# EAGLE design Power_Supply (EAGLE 9.6.1)
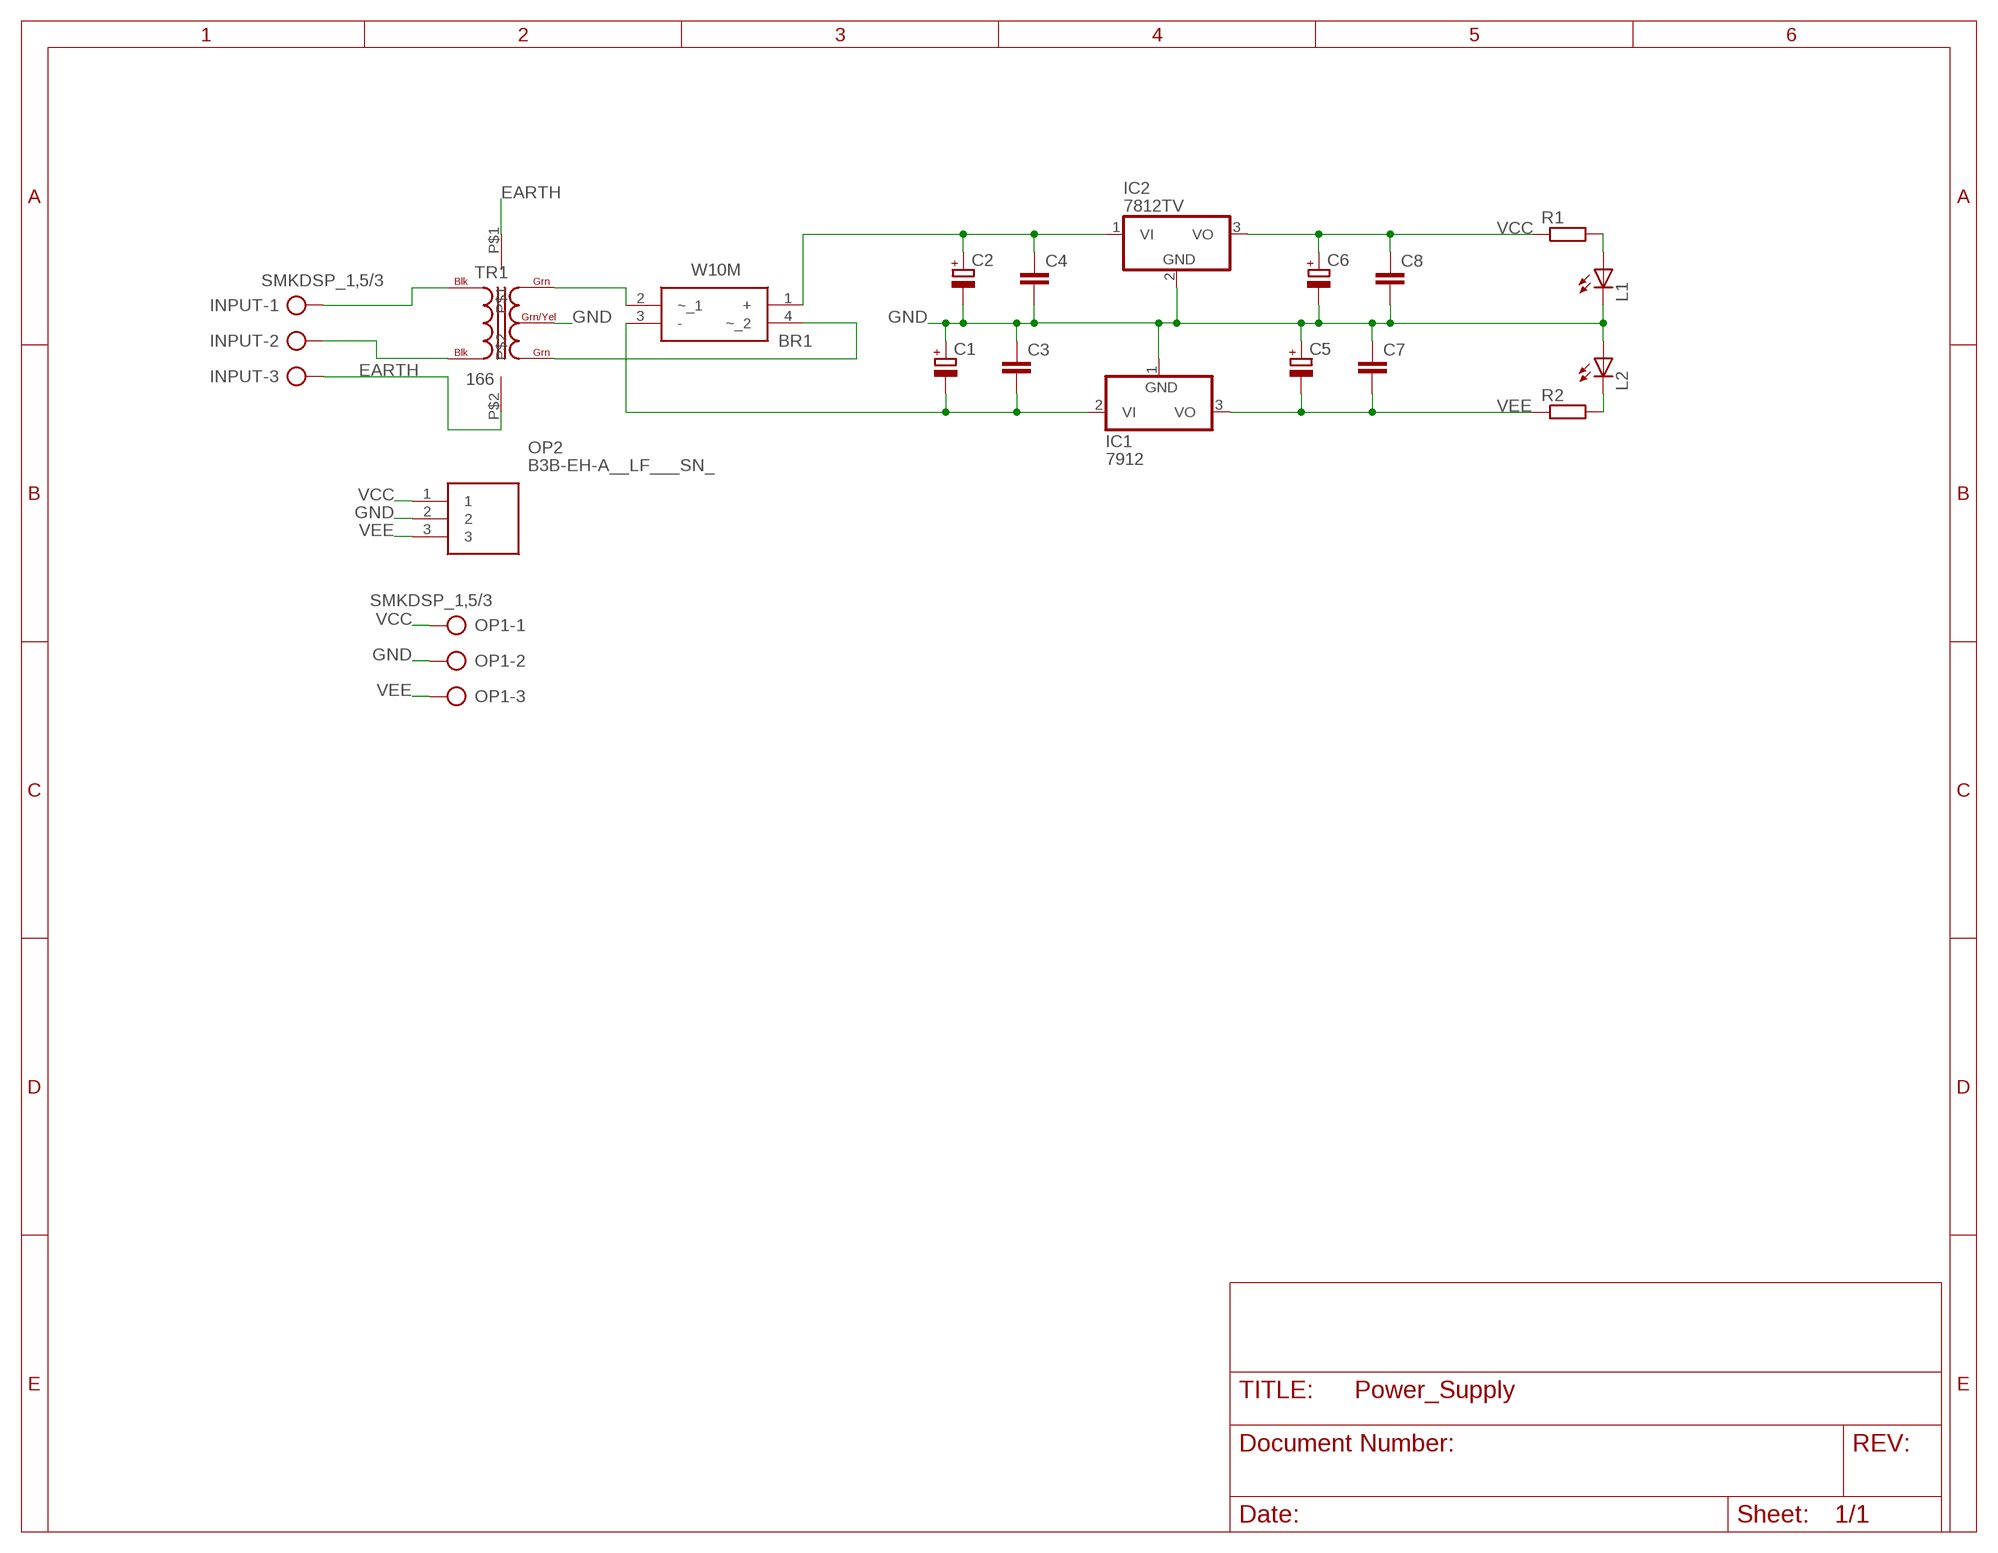
[diagram p0: schematic, sheet 1]

## Parts
BR1  W10M  [WOM]
C1  CPOL-EUE5-10.5  [E5-10,5]
C2  CPOL-EUE5-10.5  [E5-10,5]
C3  C-EU025-025X050  [C025-025X050]
C4  C-EU025-025X050  [C025-025X050]
C5  CPOL-EUE2.5-5  [E2,5-5]
C6  CPOL-EUE2.5-5  [E2,5-5]
C7  C-EU025-025X050  [C025-025X050]
C8  C-EU025-025X050  [C025-025X050]
IC1  7912  79  [TO220V]
IC2  7812TV  [TO220V]
INPUT  SMKDSP_1,5/3  [SMKDSP_1,5/3]
L1  LED3MM  [LED3MM]
L2  LED3MM  [LED3MM]
OP1  SMKDSP_1,5/3  [SMKDSP_1,5/3]
OP2  B3B-EH-A__LF___SN_  [SHDR3W64P0X250_1X3_1000X380X60]
R1  R-EU_0207/10  [0207/10]
R2  R-EU_0207/10  [0207/10]
TR1  166  [C4H]

## Nets
EARTH: INPUT.3 TR1.P$1 TR1.P$2
GND: C1.+ C2.- C3.1 C4.2 C5.+ C6.- C7.1 C8.2 IC1.1(GND) IC2.2(GND) L1.K(C) L2.A OP1.2 OP2.2 TR1.GRN/YEL
N$18: INPUT.1 TR1.BLK@1(BLK)
N$19: INPUT.2 TR1.BLK@2(BLK)
N$23: BR1.2(~_1) TR1.GRN@1(GRN)
N$24: BR1.4(~_2) TR1.GRN@2(GRN)
N$25: BR1.1(+) C2.+ C4.1 IC2.1(VI)
N$27: BR1.3(-) C1.- C3.2 IC1.2(VI)
N$28: L2.K(C) R2.2
N$29: L1.A R1.2
VCC: C6.+ C8.1 IC2.3(VO) OP1.1 OP2.1 R1.1
VEE: C5.- C7.2 IC1.3(VO) OP1.3 OP2.3 R2.1

## Library data of the parts
BR1 = W10M:W10M: Bridge Rectifiers 1.5A 1000V Source: Datasheet <https://www.arrow.com/en/products/w10m/rectron>; ARROW_PART_NUMBER: W10M; ARROW_PRICE-STOCK: https://www.arrow.com/en/products/w10m/rectron; DESCRIPTION: Bridge Rectifiers 1.5A 1000V; HEIGHT: mm; MANUFACTURER_NAME: Rectron; MANUFACTURER_PART_NUMBER: W10M; MOUSER_PART_NUMBER: 583-W10M; MOUSER_PRICE-STOCK: https://www.mouser.co.uk/ProductDetail/Rectron/W10M?qs=eFbYF5x2uRcD6P7vvkVvAQ%3D%3D
C1 C2 C5 C6 = resistor:CPOL-EU: POLARIZED CAPACITOR, European symbol
C3 C4 C7 C8 = resistor:C-EU: CAPACITOR, European symbol
IC1 = linear-Custom:79*: Negative VOLTAGE REGULATOR
IC2 = linear:78*: Positive VOLTAGE REGULATOR Source: http://cache.national.com/ds/LM/LM78L05.pdf http://www.fairchildsemi.com/ds/LM/LM7805.pdf
INPUT OP1 = con-phoenix-smkdsp:SMKDSP_1,5/3: Printklemme, Nennstrom: 17,5 A, Bemessungsspannung: 250 V, Raster: 5,0 mm Source: http://eshop.phoenixcontact.de .. 1733415.pdf; MF: FARNELL; MPN: 1733583; OC_FARNELL: 3041256; OC_NEWARK: 71C4130
L1 L2 = led:LED: LED OSRAM: - CHIPLED LG R971, LG N971, LY N971, LG Q971, LY Q971, LO R971, LY R971 LH N974, LH R974 LS Q976, LO Q976, LY Q976 LO Q996 - Hyper CHIPLED LW Q18S LB Q993, LB Q99A, LB R99A - SideLED LS A670, LO A670, LY A670, LG A670, LP A670 LB A673, LV A673, LT A673, LW A673 LH A674 LY A675 LS A676, LA A676, LO A676, LY A676, LW A676 LS A679, LY A679, LG A679 - Hyper Micro SIDELED® LS Y876, LA Y876, LO Y876, LY Y876 LT Y87S - SmartLED LW L88C, LW L88S LB L89C, LB L89S, LG L890 LS L89K, LO L89K, LY L89K LS L896, LA L896, LO L896, LY L896 - TOPLED LS T670, LO T670, LY T670, LG T670, LP T670 LSG T670, LSP T670, LSY T670, LOP T670, LYG T670 LG T671, LOG T671, LSG T671 LB T673, LV T673, LT T673, LW T673 LH T674 LS T676, LA T676, LO T676, LY T676, LB T676, LH T676, LSB T676, LW T676 LB T67C, LV T67C, LT T67C, LS T67K, LO T67K, LY T67K, LW E67C LS E67B, LA E67B, LO E67B, LY E67B, LB E67C, LV E67C, LT E67C LW T67C LS T679, LY T679, LG T679 LS T770, LO T770, LY T770, LG T770, LP T770 LB T773, LV T773, LT T773, LW T773 LH T774 LS E675, LA E675, LY E675, LS T675 LS T776, LA T776, LO T776, LY T776, LB T776 LHGB T686 LT T68C, LB T68C - Hyper Mini TOPLED® LB M676 - Mini TOPLED Santana® LG M470 LS M47K, LO M47K, LY M47K Source: http://www.osram.convergy.de LUXEON: - LUMILED® LXK2-PW12-R00, LXK2-PW12-S00, LXK2-PW14-U00, LXK2-PW14-V00 LXK2-PM12-R00, LXK2-PM12-S00, LXK2-PM14-U00 LXK2-PE12-Q00, LXK2-PE12-R00, LXK2-PE12-S00, LXK2-PE14-T00, LXK2-PE14-U00 LXK2-PB12-K00, LXK2-PB12-L00, LXK2-PB12-M00, LXK2-PB14-N00, LXK2-PB14-P00, LXK2-PB14-Q00 LXK2-PR12-L00, LXK2-PR12-M00, LXK2-PR14-Q00, LXK2-PR14-R00 LXK2-PD12-Q00, LXK2-PD12-R00, LXK2-PD12-S00 LXK2-PH12-R00, LXK2-PH12-S00 LXK2-PL12-P00, LXK2-PL12-Q00, LXK2-PL12-R00 Source: www.luxeon.com KINGBRIGHT: KA-3528ASYC Source: www.kingbright.com
OP2 = SamacSys_Parts:B3B-EH-A__LF___SN_: 3 way 1 row top entry header,2.5mm pitch JST EH Series, 2.5mm Pitch 3 Way 1 Row Straight PCB Header, Solder Termination, 3A Source: Datasheet <http://www.jst-mfg.com/product/pdf/eng/eEH.pdf>; ARROW_PART_NUMBER: B3B-EH-A (LF) (SN); DESCRIPTION: 3 way 1 row top entry header,2.5mm pitch JST EH Series, 2.5mm Pitch 3 Way 1 Row Straight PCB Header, Solder Termination, 3A; HEIGHT: 6mm; MANUFACTURER_NAME: JST (JAPAN SOLDERLESS TERMINALS); MANUFACTURER_PART_NUMBER: B3B-EH-A (LF) (SN)
R1 R2 = resistor:R-EU_: RESISTOR, European symbol
TR1 = trafo-hammondmfg-Custom:166: OPEN STYLE FILAMENT & L.V. RECTIFIER USE TRANSFORMERS Economical single primnary 115VAC, 60 Hz or 117 VAC 50/60 Hz Source: Data sheet <http://www.hammondmfg.com/166.htm>

## Board
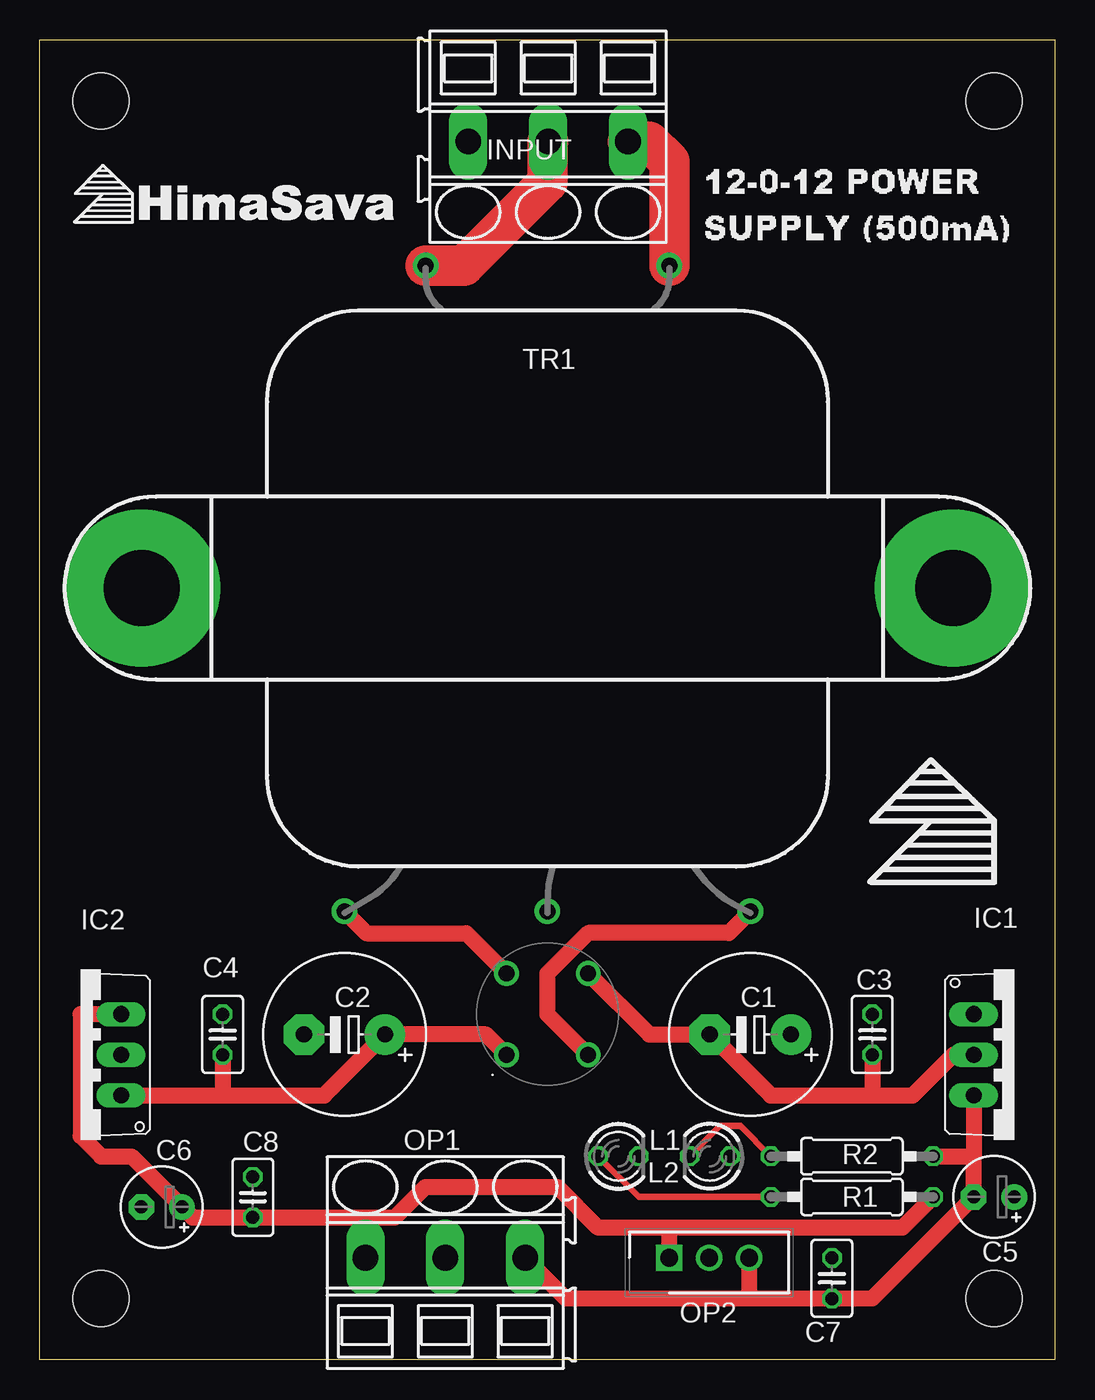
[diagram p1: board, top side]
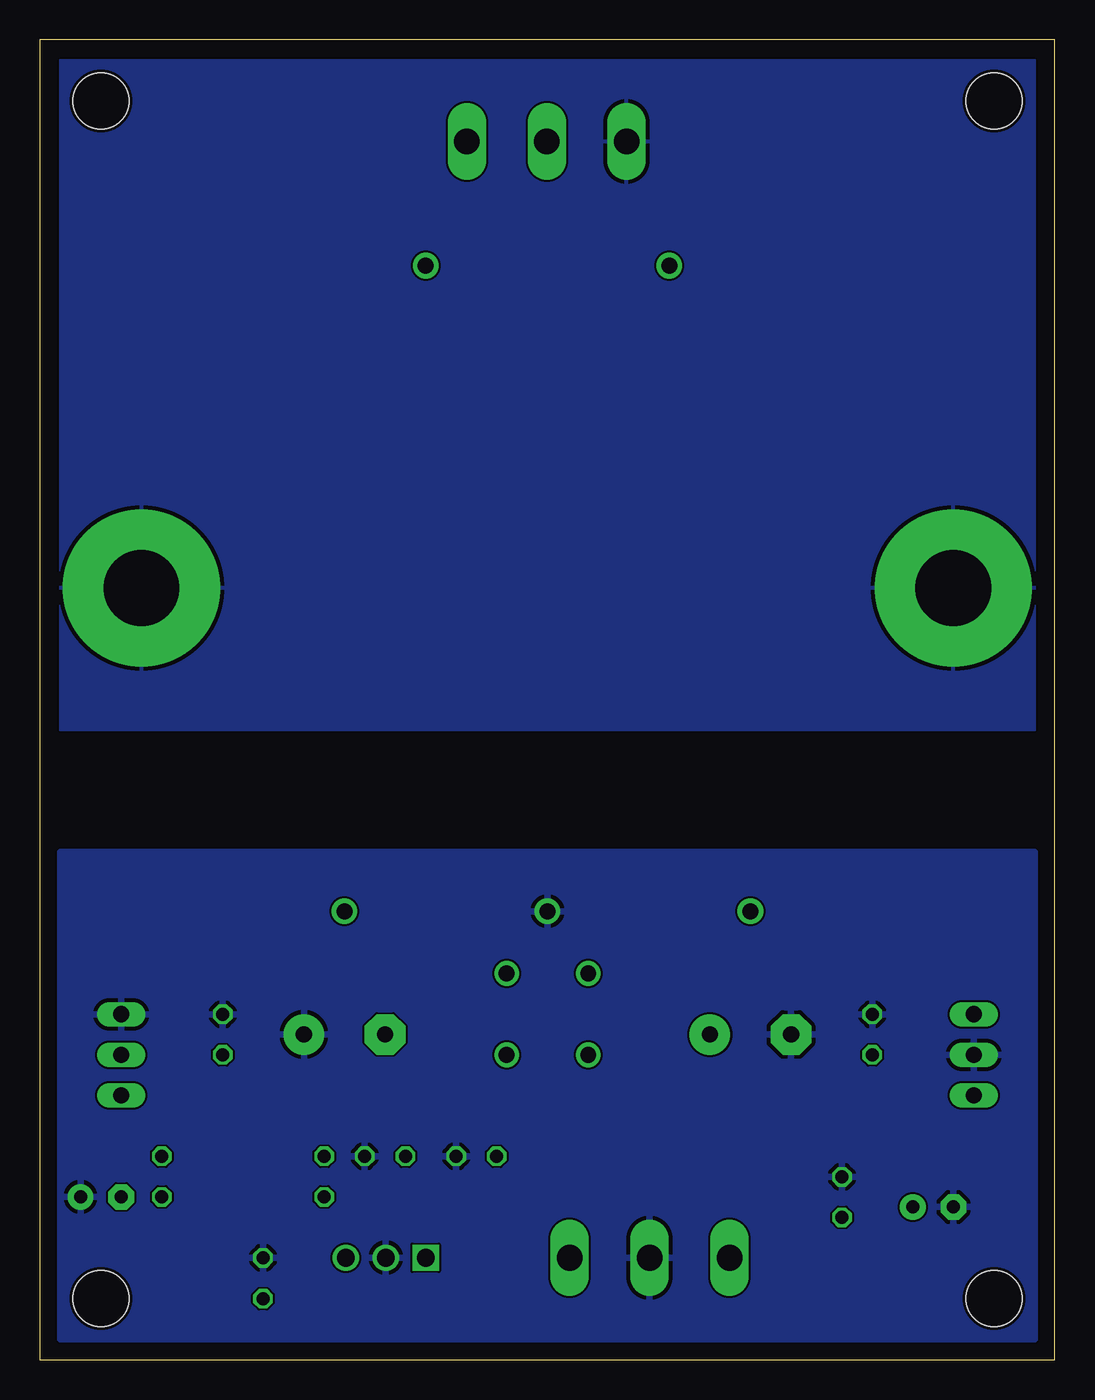
[diagram p2: board, bottom side, seen from below]

Size 63.5 x 82.55 mm. Coordinates in mm from the lower left corner, seen from the top.
Outline: 63.5,0 0,0 0,82.55 63.5,82.55 63.5,0
Copper layers (1*16): Top 0.035559375mm / dielectric 1.6mm / Bottom 0.035559375mm
Design rules "jlcpcb2layer": minimum track width 5mil, minimum drill 12mil, track to track 5mil, track to pad 5mil, pad to pad 5mil, via to via 5mil, smd to smd 5mil, copper to edge 8mil, drill to drill 6mil, minimum pad ring 5mil, minimum via ring 3mil, stop-mask expansion 2.5mil, vias tented up to drill 0mil, thermal gap 10mil
Holes 3.5 mm at 59.69,3.81 3.81,3.81 3.81,78.74 59.69,78.74

### Footprints (pad centres in the part's own frame; a part is rotated, then mirrored left to right if it is on the bottom)
WOM = drill 1 pad 1.55: 1 -2.55,-2.55; 2 2.55,-2.55; 3 2.55,2.55; 4 -2.55,2.55
E5-10,5 = drill 1.016 pad 2.54: + -2.54,0 | drill 1.016 pad 2.54 octagon: - 2.54,0
C025-025X050 = drill 0.813 octagon: 1 -1.27,0; 2 1.27,0
E2,5-5 = drill 0.813 pad 1.6: + -1.27,0 | drill 0.813 pad 1.6 octagon: - 1.27,0
TO220V = drill 1.016 long: 1 -2.54,-2.54; 2 0,-2.54; 3 2.54,-2.54
SMKDSP_1,5/3 = drill 1.6 pad 1.8 long: 1 -2.5,0; 2 2.5,0; 3 7.5,0
LED3MM = drill 0.813 octagon: A -1.27,0; K 1.27,0
SHDR3W64P0X250_1X3_1000X380X60 = drill 1.1 pad 1.65 square: 1 0,0 | drill 1.1 pad 1.65: 2 2.5,0; 3 5,0
0207/10 = drill 0.813 octagon: 1 -5.08,0; 2 5.08,0
C4H = drill 1 pad 1.6: BLK@1 -7.62,-20.17; BLK@2 7.62,-20.17; GRN/YEL 0,20.22; GRN@1 -12.7,20.22; GRN@2 12.7,20.22 | drill 4.75 pad 9.83: P$1 -25.4,0; P$2 25.4,0

### Placement (x,y rotation side)
BR1  31.75,21.61 0 top
C1  44.45,20.34 180 top
C2  19.05,20.34 180 top
C3  52.07,20.34 270 top
C4  11.43,20.34 90 top
C5  59.69,10.18 180 top
C6  7.62,9.54 180 top
C7  49.55,5.08 270 top
C8  13.32,10.16 90 top
IC1  60.96,19.07 270 top
IC2  2.54,19.07 90 top
INPUT  34.29,76.2 180 top
L1  36.19,12.72 0 top
L2  41.91,12.72 180 top
OP1  22.86,6.37 0 top
OP2  39.37,6.37 0 top
R1  50.8,10.18 180 top
R2  50.8,12.72 180 top
TR1  31.75,48.26 180 top

### Tracks (layer width: path | path; a pad name or v marks a point on that pad's centre or on a via)
EARTH
  pour Bottom: 1.27,39.37 62.23,39.37 62.23,81.28 1.27,81.28
GND
  pour Bottom: 62.23,1.27 1.27,1.27 1.27,31.75 62.23,31.75
N$18
  Top 2.54: INPUT.1 38.1,76.2 39.37,74.93 TR1.BLK@1
N$19
  Top 2.54: INPUT.2 31.75,76.16 31.75,73.66 26.52,68.43 TR1.BLK@2
N$23
  Top 1.016: BR1.2 31.75,21.61 31.75,24.14 34.29,26.68 43.1,26.68 TR1.GRN@1
N$24
  Top 1.016: BR1.4 26.68,26.67 20.42,26.67 TR1.GRN@2
N$25
  Top 1.016: BR1.1 27.92,20.34 C2.+ 17.78,16.52 11.43,16.52 | IC2.1 11.43,16.52 | C4.1 11.43,16.52
N$27
  Top 1.016: BR1.3 38.12,20.34 C1.- 45.72,16.52 52.07,16.52 | IC1.2 57.15,19.07 54.61,16.52 52.07,16.52 | C3.2 52.07,16.52
N$28
  Top 0.406: R2.2 45.7,12.71 43.81,14.61 42.53,14.61 L2.K
N$29
  Top 0.406: R1.2 37.46,10.18 L1.A
VCC
  Top 1.016: IC2.3 2.54,21.61 2.54,13.98 3.82,12.7 5.73,12.7 C6.+ 9.54,8.89 C8.1 20.32,8.89 | R1.1 53.96,8.26 39.37,8.26 | 39.37,8.26 34.92,8.26 32.38,10.79 24.11,10.79 22.21,8.89 20.32,8.89 | OP2.1 39.37,8.25 39.37,8.26 | OP1.1 20.36,8.85 20.32,8.89
VEE
  Top 1.016: IC1.3 58.42,12.71 | R2.1 58.42,12.71 | 44.45,3.81 C7.2 52.05,3.81 C5.- 58.42,12.71 | 44.45,3.81 32.91,3.81 OP1.3 | OP2.3 44.37,3.9 44.45,3.81

### Text on the board
tPlace: D:/Drive/Logo2.0.bmp